# Altium schematic sheet 飞控.SchDoc: Fly_Control
size A4; CompanyName: BUPT; DrawnBy: BUPT_HCM; Organization: BUPT_Robot; Revision: A; SheetNumber: 1; SheetTotal: 2; Version: 1.0; LibVersion: 1.0
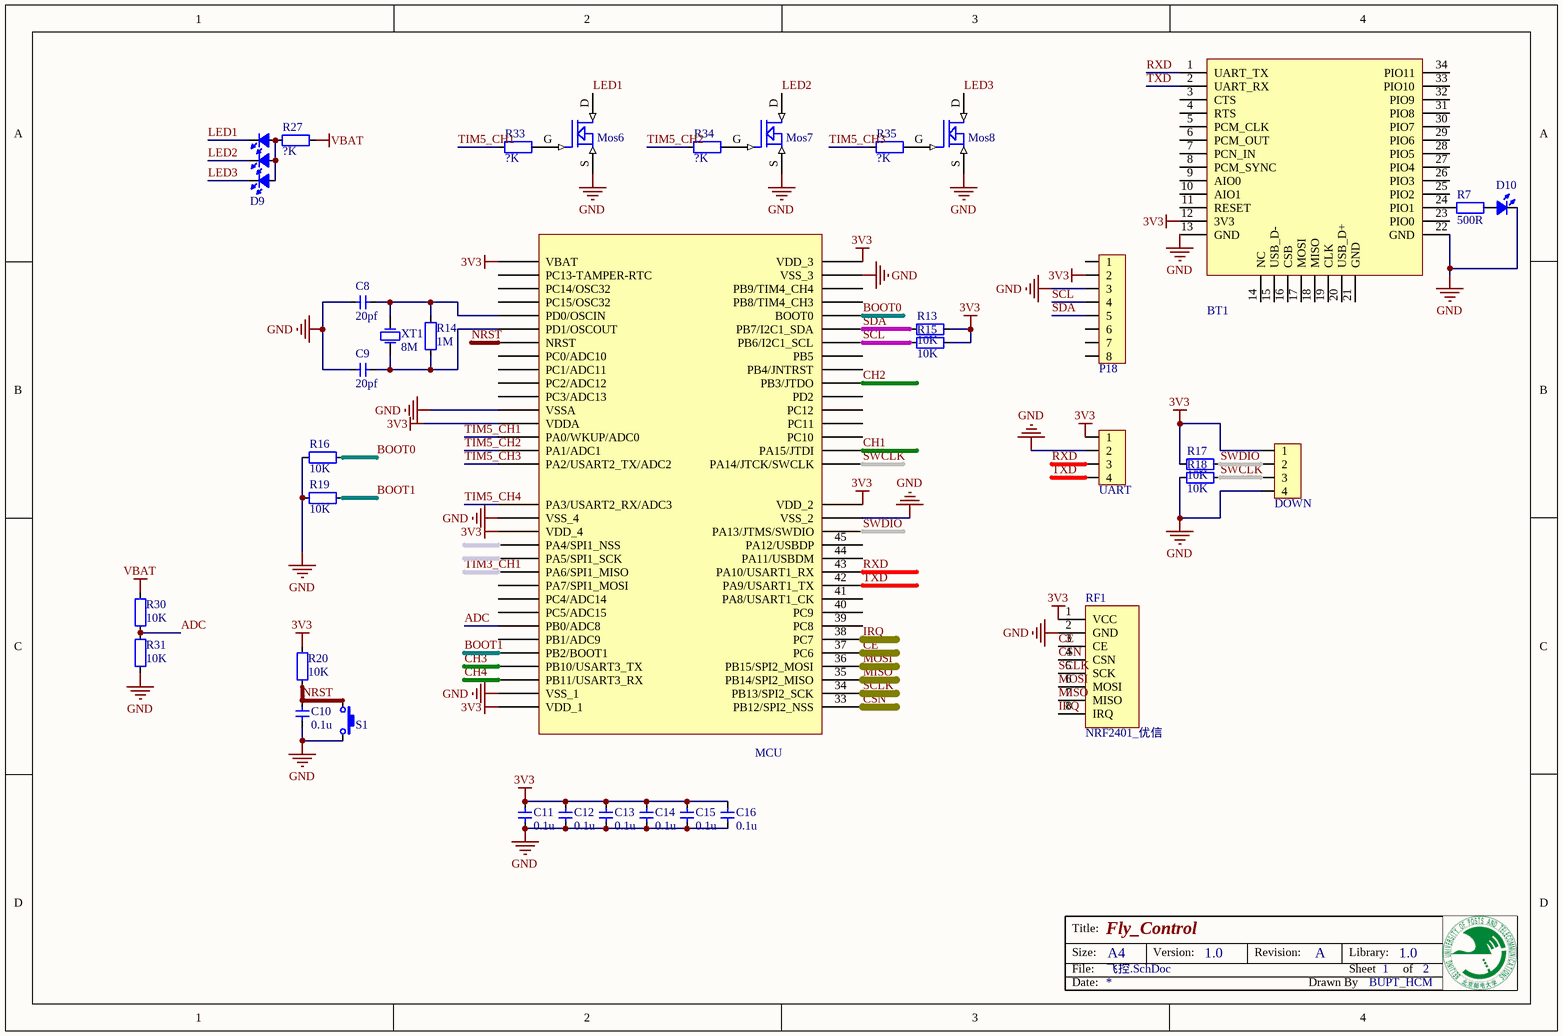
[diagram p0: 飞控.SchDoc]

## Parts
BT1  Bluetooth_HC05  [Bluetooth_HC05]  (value not drawn)
C8  value 20pf  [CAP_0603]  (hidden comment: Cap_0603)
C9  value 20pf  [CAP_0603]  (hidden comment: Cap_0603)
C10  value 0.1u  [CAP_0603]  (hidden comment: Cap_0603)
C11  value 0.1u  [CAP_0603]  (hidden comment: Cap_0603)
C12  value 0.1u  [CAP_0603]  (hidden comment: Cap_0603)
C13  value 0.1u  [CAP_0603]  (hidden comment: Cap_0603)
C14  value 0.1u  [CAP_0603]  (hidden comment: Cap_0603)
C15  value 0.1u  [CAP_0603]  (hidden comment: Cap_0603)
C16  value 0.1u  [CAP_0603]  (hidden comment: Cap_0603)
D9  LED_5050_RGB  [LED_5050_6P]  (value not drawn)
D10  LED_0805  [LED_0805_BLUE]  (value not drawn)
DOWN  HDR1x4_2.54  [HDR1X4_2.54_90]  (value not drawn)
MCU  STM32F103RC  [LQFP_P0.5_64]  (value not drawn)
Mos6  MOSFET N  [Nmos_SOT23]  (value not drawn)
Mos7  MOSFET N  [Nmos_SOT23]  (value not drawn)
Mos8  MOSFET N  [Nmos_SOT23]  (value not drawn)
P18  HDR1x8_2.54  [HDR1X8_2.54_180]  (value not drawn)
R7  value 500R  [RES_0603]  (hidden comment: Res_0603)
R13  value 10K  [RES_0603]  (hidden comment: Res_0603)
R14  value 1M  [RES_0603]  (hidden comment: Res_0603)
R15  value 10K  [RES_0603]  (hidden comment: Res_0603)
R16  value 10K  [RES_0603]  (hidden comment: Res_0603)
R17  value 10K  [RES_0603]  (hidden comment: Res_0603)
R18  value 10K  [RES_0603]  (hidden comment: Res_0603)
R19  value 10K  [RES_0603]  (hidden comment: Res_0603)
R20  value 10K  [RES_0603]  (hidden comment: Res_0603)
R27  value ?K  [RES_0603]  (hidden comment: Res_0603)
R30  value 10K  [RES_0603]  (hidden comment: Res_0603)
R31  value 10K  [RES_0603]  (hidden comment: Res_0603)
R33  value ?K  [RES_0603]  (hidden comment: Res_0603)
R34  value ?K  [RES_0603]  (hidden comment: Res_0603)
R35  value ?K  [RES_0603]  (hidden comment: Res_0603)
RF1  NRF2401_优信  [nrf24l01_youxin]
S1  ButtonTACT_3x4x2_180  [ButtonTACT_3x4x2_180H]  (value not drawn)
UART  HDR1x4_2.54  [HDR1x4_2.54_180]  (value not drawn)
XT1  value 8M  [XT_5032_2]  (hidden comment: XTAL_5032_2P)

## Nets
3V3: BT1.12(3V3) C11.2 C12.2 C13.2 C14.2 C15.2 C16.2 DOWN.1 MCU.1(VBAT) MCU.13(VDDA) MCU.19(VDD_4) MCU.32(VDD_1) MCU.48(VDD_2) MCU.64(VDD_3) P18.2 R13.2 R15.2 R17.2 R20.1 RF1.1(VCC) UART.1
GND: BT1.13(GND) BT1.22(GND) C8.1 C9.1 C10.1 C11.1 C12.1 C13.1 C14.1 C15.1 C16.1 D10.2(K) DOWN.4 MCU.12(VSSA) MCU.18(VSS_4) MCU.31(VSS_1) MCU.47(VSS_2) MCU.63(VSS_3) Mos6.S Mos7.S Mos8.S P18.3 R16.2 R18.2 R19.2 R31.1 RF1.2(GND) S1.2 UART.2
VBAT: R27.1 R30.2
ADC: MCU.26(PB0/ADC8) R30.1 R31.2
BOOT0: MCU.60(BOOT0) R16.1
BOOT1: MCU.28(PB2/BOOT1) R19.1
CE: MCU.37(PC6) RF1.3(CE)
CH1: MCU.50(PA15/JTDI)
CH2: MCU.55(PB3/JTDO)
CH3: MCU.29(PB10/USART3_TX)
CH4: MCU.30(PB11/USART3_RX)
CSN: MCU.33(PB12/SPI2_NSS) RF1.4(CSN)
IRQ: MCU.38(PC7) RF1.8(IRQ)
LED1: D9.3(K) Mos6.D
LED2: D9.2(K) Mos7.D
LED3: D9.1(K) Mos8.D
MISO: MCU.35(PB14/SPI2_MISO) RF1.7(MISO)
MOSI: MCU.36(PB15/SPI2_MOSI) RF1.6(MOSI)
NRST: C10.2 MCU.7(NRST) R20.2 S1.1
RXD: BT1.1(UART_TX) MCU.43(PA10/USART1_RX) UART.3
SCL: MCU.58(PB6/I2C1_SCL) P18.4 R15.1
SCLK: MCU.34(PB13/SPI2_SCK) RF1.5(SCK)
SDA: MCU.59(PB7/I2C1_SDA) P18.5 R13.1
SWCLK: DOWN.3 MCU.49(PA14/JTCK/SWCLK) R18.1
SWDIO: DOWN.2 MCU.46(PA13/JTMS/SWDIO) R17.1
TIM3_CH1: MCU.22(PA6/SPI1_MISO)
TIM5_CH1: MCU.14(PA0/WKUP/ADC0) R33.1
TIM5_CH2: MCU.15(PA1/ADC1) R34.1
TIM5_CH3: MCU.16(PA2/USART2_TX/ADC2) R35.1
TIM5_CH4: MCU.17(PA3/USART2_RX/ADC3)
TXD: BT1.2(UART_RX) MCU.42(PA9/USART1_TX) UART.4
NetBT1_24: BT1.24(PIO1) R7.1
NetC8_2: C8.2 MCU.5(PD0/OSCIN) R14.2 XT1.2(OSC2)
NetC9_2: C9.2 MCU.6(PD1/OSCOUT) R14.1 XT1.1(OSC1)
NetD9_4: D9.4(A) D9.5(A) D9.6(A) R27.2
NetD10_1: D10.1(A) R7.2
NetMos6_G: Mos6.G R33.2
NetMos7_G: Mos7.G R34.2
NetMos8_G: Mos8.G R35.2

Not connected (* = marked no-connect by the designer): BT1 3(CTS) 4(RTS) 5(PCM_CLK) 6(PCM_OUT) 7(PCN_IN) 8(PCM_SYNC) 9(AIO0) 10(AIO1) 11(RESET) 14(NC) 15(USB_D-) 16(CSB) 17(MOSI) 18(MISO) 19(CLK) 20(USB_D+) 21(GND) 23(PIO0) 25(PIO2) 26(PIO3) 27(PIO4) 28(PIO5) 29(PIO6) 30(PIO7) 31(PIO8) 32(PIO9) 33(PIO10) 34(PIO11); MCU 2(PC13-TAMPER-RTC) 3(PC14/OSC32) 4(PC15/OSC32) 8(PC0/ADC10) 9(PC1/ADC11) 10(PC2/ADC12) 11(PC3/ADC13) 20(PA4/SPI1_NSS) 21(PA5/SPI1_SCK) 23(PA7/SPI1_MOSI) 24(PC4/ADC14) 25(PC5/ADC15) 27(PB1/ADC9) 39(PC8) 40(PC9) 41(PA8/USART1_CK) 44(PA11/USBDM) 45(PA12/USBDP) 51(PC10) 52(PC11) 53(PC12) 54(PD2) 56(PB4/JNTRST) 57(PB5) 61(PB8/TIM4_CH3) 62(PB9/TIM4_CH4); P18 1 6 7 8

## Notes on the sheet
- Title:
- Size:
- Date:
- File:
- A4
- Version:
- Revision:
- Drawn By
- Sheet
- Library:
- of

## Library data of the parts
BT1 = Bluetooth_HC05: Module
C8-C16 = Cap_0603: Capacitor
D9 = LED_5050_RGB: LED
D10 = LED_0805: LED
DOWN UART = HDR1x4_2.54: Header
MCU = STM32F103RC: MCU
Mos6-Mos8 = MOSFET N: MOS SOT23
P18 = HDR1x8_2.54: Header
R7 R13-R20 R27 R30 R31 R33-R35 = Res_0603: Resistor
S1 = ButtonTACT_3x4x2_180: Button
XT1 = XTAL_5032_2P: Crystal Oscillator